# Altium schematic sheet c_meter.SchDoc
size A4
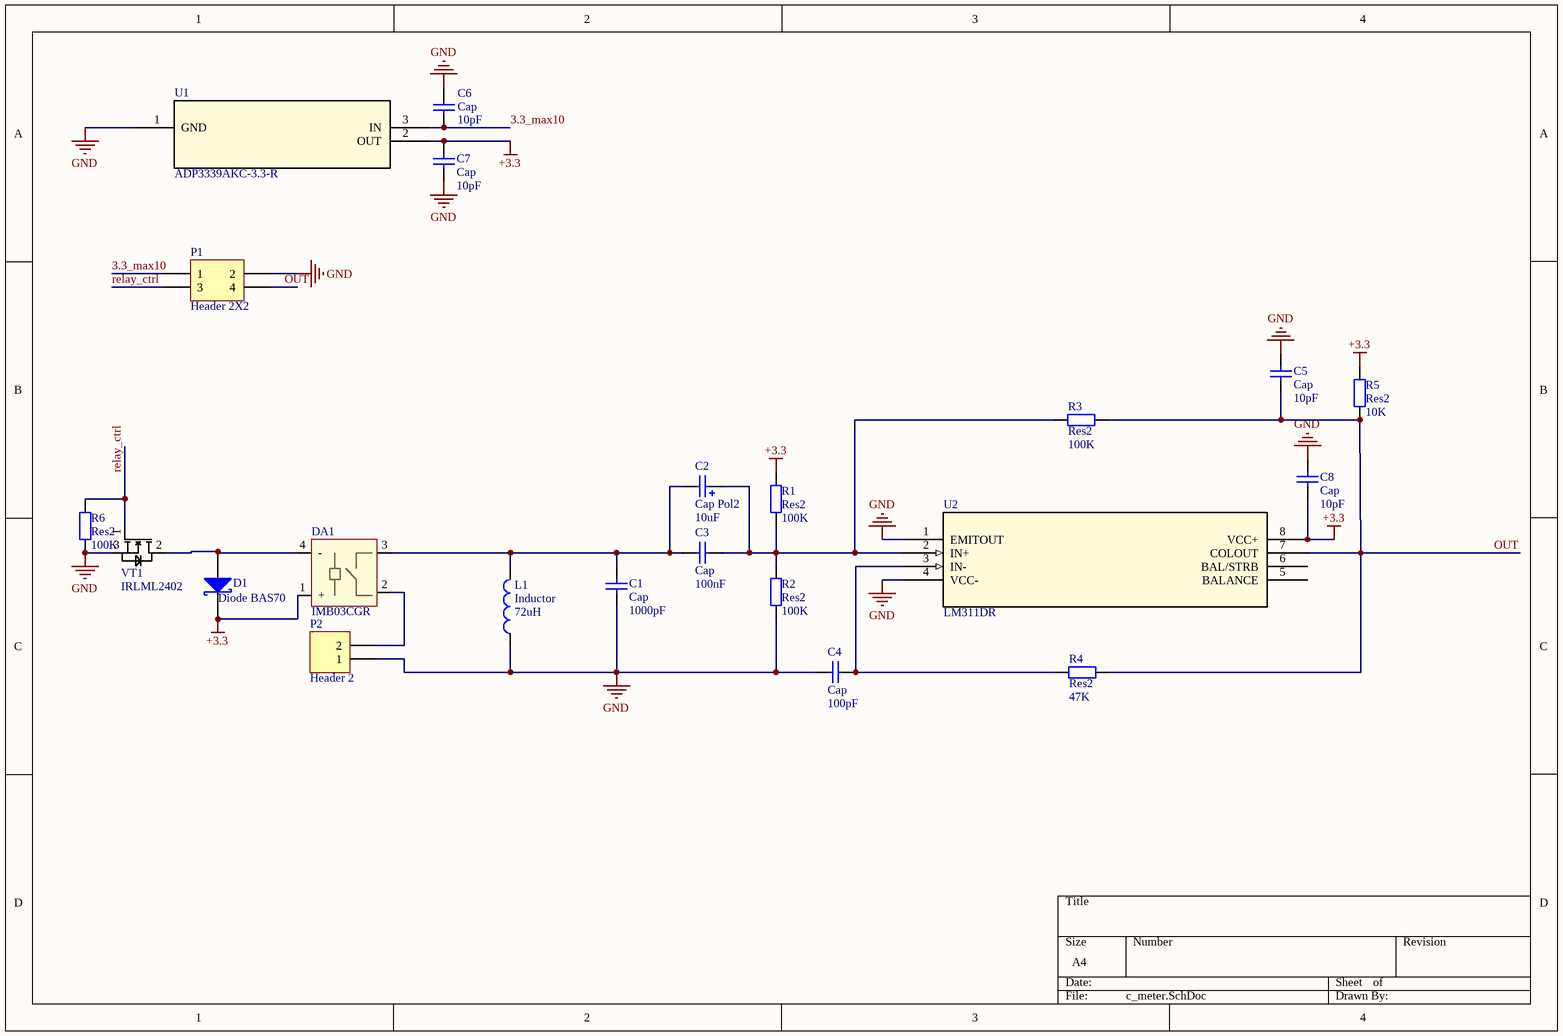
[diagram p0: c_meter.SchDoc]

## Parts
C1  Cap  value 1000pF  [C0805]
C2  Cap Pol2  value 10uF  [CAPR5-4X5]
C3  Cap  value 100nF  [C0805]
C4  Cap  value 100pF  [C0805]
C5  Cap  value 10pF  [C0805]
C6  Cap  value 10pF  [C0805]
C7  Cap  value 10pF  [C0805]
C8  Cap  value 10pF  [C0805]
D1  Diode BAS70  [SOT-23_N]
DA1  IMB03CGR  [IMB03CGR]
L1  Inductor  value 72uH  [AXIAL-0.5]
P1  Header 2X2  [HDR2X2]
P2  Header 2  [HDR1X2]
R1  Res2  value 100K  [6-0805_N]
R2  Res2  value 100K  [6-0805_N]
R3  Res2  value 100K  [6-0805_N]
R4  Res2  value 47K  [6-0805_N]
R5  Res2  value 10K  [6-0805_N]
R6  Res2  value 100K  [6-0805_N]
U1  ADP3339AKC-3.3-R  [KC_3]
U2  LM311DR  [D8]
VT1  IRLML2402  [IRLML2402]

## Nets
+3.3: C7.1 C8.2 D1.3(K) DA1.1(+) R1.2 R5.2 U1.2(OUT) U2.8(VCC+)
GND: C1.1 C4.1 C5.2 C6.1 C7.2 C8.1 L1.1 P1.2 P2.1 R2.1 R6.1 U1.1(GND) U2.1(EMITOUT) U2.4(VCC-) VT1.3(D)
3.3_max10: C6.2 P1.1 U1.3(IN)
OUT: C5.1 P1.4 R3.2 R4.2 R5.1 U2.7(COLOUT)
relay_ctrl: P1.3 R6.2 VT1.1(G)
NetC1_2: C1.2 C2.2 C3.1 DA1.3 L1.2
NetC2_1: C2.1 C3.2 R1.1 R2.2 R3.1 U2.2(IN+)
NetC4_2: C4.2 R4.1 U2.3(IN-)
NetD1_1: D1.1(A) DA1.4(-) VT1.2(S)
NetDA1_2: DA1.2 P2.2

Not connected (* = marked no-connect by the designer): U2 5(BALANCE) 6(BAL/STRB)

## Library data of the parts
C1 C3-C8 = Cap: Capacitor; Published: 8-Jun-2000; LatestRevisionDate: 17-Jul-2002; LatestRevisionNote: Re-released for DXP Platform.; PackageReference: RAD-0.3; Publisher: Altium Limited; PackageDescription: Radial Cap, Thru-Hole; 2 Leads; 0.3 in Pin Spacing
C2 = Cap Pol2: Polarized Capacitor (Axial); Published: 8-Jun-2000; LatestRevisionDate: 17-Jul-2002; LatestRevisionNote: Re-released for DXP Platform.; PackageReference: POLAR0.8; Publisher: Altium Limited; PackageDescription: Polarized Capacitor; 2 Leads
D1 = Diode BAS70: Silicon AF Schottky Diode for High-Speed Switching; Note: Pin 2 is not connected and not drawn.; Published: 21-Mar-2003; LatestRevisionDate: 29-May-2009; LatestRevisionNote: IPC-7351 Footprint Added.; DatasheetVersion: Oct-1999; PackageVersion: Sep-2001; PackageReference: SOT-23; Publisher: Altium Limited; PackageDescription: 3-Pin SOT-23 Package 0.95 mm Pitch, 2.5 mm Lead Span; ComponentLink1Description: Manufacturer Link; ComponentLink1URL: http://www.infineon.com/; ComponentLink2Description: Datasheet; ComponentLink2URL: http://www.infineon.com/upload/Document/cmc_upload/documents/009/382/bas40_bas140series_1.pdf
DA1 = IMB03CGR: Relay
L1 = Inductor: Code_IEC: 1005; Published: 8-Jun-2000; LatestRevisionDate: 29-May-2009; LatestRevisionNote: IPC-7351 Footprint Added.; PackageReference: 0402-A; Publisher: Altium Limited; PackageDescription: Chip Inductor; Code_JEITA: 0402
P1 = Header 2X2: Header, 2-Pin, Dual row; LatestRevisionDate: 17-Jul-2002; LatestRevisionNote: Re-released for DXP Platform.; Publisher: Altium Limited
P2 = Header 2: Header, 2-Pin; LatestRevisionDate: 17-Jul-2002; LatestRevisionNote: Re-released for DXP Platform.; Publisher: Altium Limited
R1-R6 = Res2: Resistor; Published: 8-Jun-2000; LatestRevisionDate: 17-Jul-2002; LatestRevisionNote: Re-released for DXP Platform.; PackageReference: AXIAL-0.4; Publisher: Altium Limited; PackageDescription: Axial Device, Thru-Hole; 2 Leads; 0.4 in Pin Spacing
U1 = ADP3339AKC-3.3-R: Imported; Manufacturer_Part_Number: ADP3339AKC-3.3-RL; Vendor: Analog Devices Inc; Built_By: EMA_UL_Team; C: Copyright (C) 2015 Accelerated Designs. All rights reserved; RefDes: RefDes; Type: DEV; Value: Value
U2 = LM311DR: Imported; Manufacturer: Texas Instruments; Built_By: EMA_UL_Team; C: Copyright (C) 2015 Accelerated Designs. All rights reserved; Vendor: Vendor; Manufacturer_Part_Number: LM311DR; RefDes: RefDes; Type: DEV; Value: Value
VT1 = IRLML2402: Voltage Source; Note: PCB Footprint - Not required; Published: 8-Jun-2000; LatestRevisionDate: 17-Jul-2002; LatestRevisionNote: Re-released for DXP Platform.; PackageReference: Not Applicable; Publisher: Altium Limited